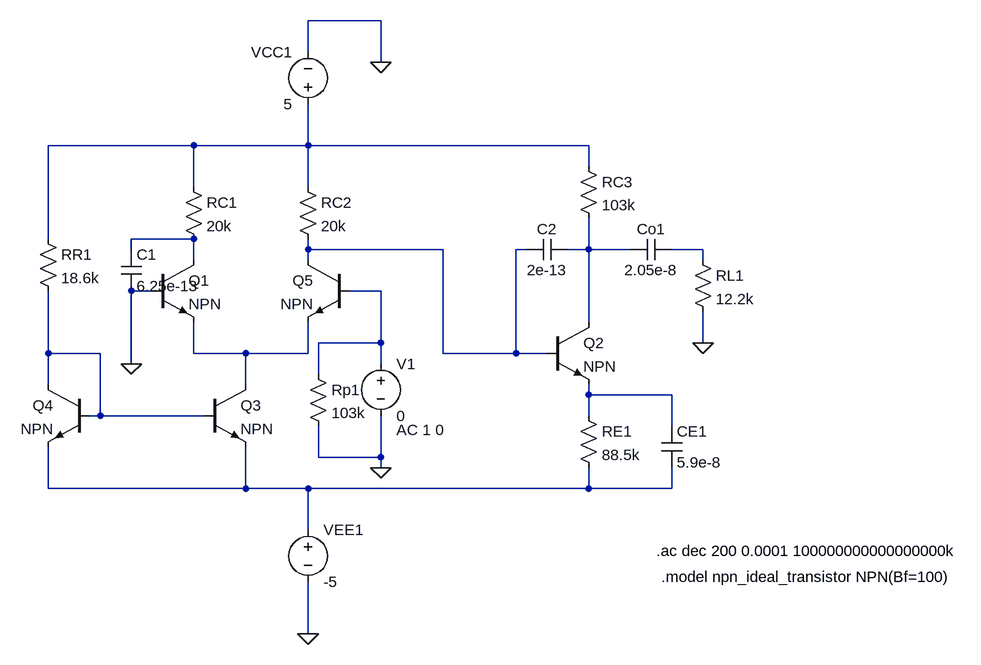
[diagram p0: schematic Draft2.asc]
Draft2.asc, the LTspice schematic file:
Version 4
SHEET 1 1324 704
WIRE 400 -256 288 -256
WIRE 288 -208 288 -256
WIRE 400 -192 400 -256
WIRE 112 -64 -112 -64
WIRE 288 -64 288 -128
WIRE 288 -64 112 -64
WIRE 720 -64 288 -64
WIRE 720 -32 720 -64
WIRE 112 0 112 -64
WIRE 288 0 288 -64
WIRE -112 80 -112 -64
WIRE 112 80 16 80
WIRE 16 96 16 80
WIRE 288 96 288 80
WIRE 496 96 288 96
WIRE 624 96 608 96
WIRE 720 96 720 48
WIRE 720 96 688 96
WIRE 784 96 720 96
WIRE 896 96 848 96
WIRE 112 112 112 80
WIRE 288 112 288 96
WIRE 896 112 896 96
WIRE 48 160 16 160
WIRE 400 160 352 160
WIRE 720 208 720 96
WIRE 400 240 400 160
WIRE 400 240 304 240
WIRE 896 240 896 192
WIRE -112 256 -112 160
WIRE -32 256 -112 256
WIRE 112 256 112 208
WIRE 192 256 112 256
WIRE 288 256 288 208
WIRE 288 256 192 256
WIRE 496 256 496 96
WIRE 608 256 608 96
WIRE 608 256 496 256
WIRE 656 256 608 256
WIRE 16 272 16 160
WIRE 400 272 400 240
WIRE 304 288 304 240
WIRE -112 304 -112 256
WIRE 192 304 192 256
WIRE 720 320 720 304
WIRE 848 320 720 320
WIRE -32 352 -32 256
WIRE -32 352 -48 352
WIRE 128 352 -32 352
WIRE 720 352 720 320
WIRE 848 368 848 320
WIRE 304 416 304 368
WIRE 400 416 400 352
WIRE 400 416 304 416
WIRE 400 432 400 416
WIRE -112 464 -112 400
WIRE 192 464 192 400
WIRE 192 464 -112 464
WIRE 288 464 192 464
WIRE 720 464 720 432
WIRE 720 464 288 464
WIRE 848 464 848 432
WIRE 848 464 720 464
WIRE 288 528 288 464
WIRE 288 688 288 608
FLAG 896 240 0
FLAG 288 688 0
FLAG 400 -192 0
FLAG 16 272 0
FLAG 400 432 0
SYMBOL res 96 -16 R0
SYMATTR InstName RC1
SYMATTR Value 20k
SYMBOL res 272 -16 R0
SYMATTR InstName RC2
SYMATTR Value 20k
SYMBOL Res 704 336 R0
SYMATTR InstName RE1
SYMATTR Value 88.5k
SYMBOL Res -128 64 R0
SYMATTR InstName RR1
SYMATTR Value 18.6k
SYMBOL Res 704 -48 R0
SYMATTR InstName RC3
SYMATTR Value 103k
SYMBOL npn 48 112 R0
SYMATTR InstName Q1
SYMBOL npn 656 208 R0
SYMATTR InstName Q2
SYMBOL npn 128 304 R0
SYMATTR InstName Q3
SYMBOL npn -48 304 M0
SYMATTR InstName Q4
SYMBOL npn 352 112 M0
SYMATTR InstName Q5
SYMBOL voltage 288 512 R0
SYMATTR InstName VEE1
SYMATTR Value -5
SYMBOL voltage 288 -112 R180
WINDOW 0 24 96 Left 2
WINDOW 3 24 16 Left 2
SYMATTR InstName VCC1
SYMATTR Value 5
SYMBOL Res 880 96 R0
SYMATTR InstName RL1
SYMATTR Value 12.2k
SYMBOL Voltage 400 256 R0
WINDOW 123 24 118 Left 2
SYMATTR Value2 AC 1 0
SYMATTR InstName V1
SYMATTR Value 0
SYMBOL cap 848 80 R90
WINDOW 0 0 32 VBottom 2
WINDOW 3 32 32 VTop 2
SYMATTR InstName Co1
SYMATTR Value 2.05e-8
SYMBOL cap 832 368 R0
SYMATTR InstName CE1
SYMATTR Value 5.9e-8
SYMBOL Res 288 272 R0
SYMATTR InstName Rp1
SYMATTR Value 103k
SYMBOL cap 0 96 R0
SYMATTR InstName C1
SYMATTR Value 6.25e-13
SYMBOL cap 688 80 R90
WINDOW 0 0 32 VBottom 2
WINDOW 3 32 32 VTop 2
SYMATTR InstName C2
SYMATTR Value 2e-13
TEXT 824 560 Left 2 !.ac dec 200 0.0001 100000000000000000k
TEXT 832 600 Left 2 !.model npn_ideal_transistor NPN(Bf=100)

The netlist it stands for:
* Draft2.asc
RC1 N001 N002 20k
RC2 N001 N003 20k
RE1 N009 N010 88.5k
RR1 N001 N007 18.6k
RC3 N001 N004 103k
Q1 N002 0 N008 0 NPN
Q2 N004 N003 N009 0 NPN
Q3 N008 N007 N010 0 NPN
Q4 N007 N007 N010 0 NPN
Q5 N003 N006 N008 0 NPN
VEE1 N010 0 -5
VCC1 N001 0 5
RL1 N005 0 12.2k
V1 N006 0 0 AC 1 0
Co1 N005 N004 2.05e-8
CE1 N009 N010 5.9e-8
Rp1 N006 0 103k
C1 N002 0 6.25e-13
C2 N004 N003 2e-13
.model NPN NPN
.model PNP PNP
.lib standard.bjt
.ac dec 200 0.0001 100000000000000000k
.model npn_ideal_transistor NPN(Bf=100)
.backanno
.end